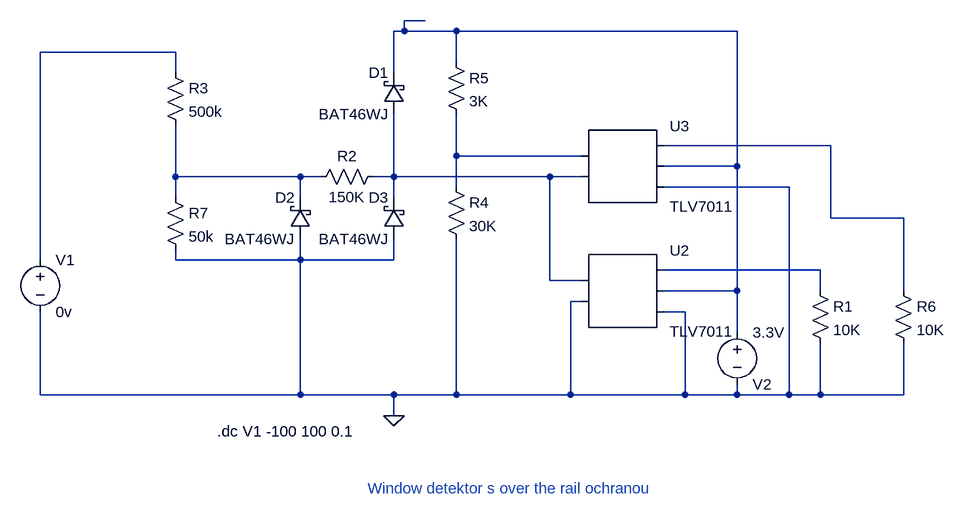
[diagram p0: schematic protection_alternativa.asc]
protection_alternativa.asc, the LTspice schematic file:
Version 4
SHEET 1 1204 680
WIRE 304 -240 272 -240
WIRE 272 -224 272 -240
WIRE 272 -224 256 -224
WIRE 352 -224 272 -224
WIRE 784 -224 352 -224
WIRE -80 -192 -288 -192
WIRE 352 -176 352 -224
WIRE -80 -160 -80 -192
WIRE 256 -160 256 -224
WIRE 928 -48 672 -48
WIRE 352 -32 352 -96
WIRE 544 -32 352 -32
WIRE 784 -16 784 -224
WIRE 784 -16 672 -16
WIRE -80 0 -80 -80
WIRE 112 0 -80 0
WIRE 144 0 112 0
WIRE 256 0 256 -96
WIRE 256 0 224 0
WIRE 496 0 256 0
WIRE 544 0 496 0
WIRE 352 16 352 -32
WIRE 864 16 672 16
WIRE -80 32 -80 0
WIRE 112 32 112 0
WIRE 256 32 256 0
WIRE 928 64 928 -48
WIRE 1040 64 928 64
WIRE -288 128 -288 -192
WIRE -80 128 -80 112
WIRE 112 128 112 96
WIRE 112 128 -80 128
WIRE 256 128 256 96
WIRE 256 128 112 128
WIRE 912 144 672 144
WIRE 496 160 496 0
WIRE 544 160 496 160
WIRE 784 176 784 -16
WIRE 784 176 672 176
WIRE 912 176 912 144
WIRE 1040 176 1040 64
WIRE 544 192 528 192
WIRE 704 208 672 208
WIRE 784 240 784 176
WIRE -288 336 -288 208
WIRE 112 336 112 128
WIRE 112 336 -288 336
WIRE 256 336 112 336
WIRE 352 336 352 96
WIRE 352 336 256 336
WIRE 528 336 528 192
WIRE 528 336 352 336
WIRE 704 336 704 208
WIRE 704 336 528 336
WIRE 784 336 784 320
WIRE 784 336 704 336
WIRE 864 336 864 16
WIRE 864 336 784 336
WIRE 912 336 912 256
WIRE 912 336 864 336
WIRE 1040 336 1040 256
WIRE 1040 336 912 336
WIRE 256 368 256 336
FLAG 256 368 0
SYMBOL voltage -288 112 R0
WINDOW 123 0 0 Left 0
WINDOW 39 0 0 Left 0
SYMATTR InstName V1
SYMATTR Value 0v
SYMBOL res 128 16 R270
WINDOW 0 32 56 VTop 2
WINDOW 3 0 56 VBottom 2
SYMATTR InstName R2
SYMATTR Value 150K
SYMBOL voltage 784 224 R0
WINDOW 0 24 96 Left 2
WINDOW 3 24 16 Left 2
WINDOW 123 0 0 Left 0
WINDOW 39 0 0 Left 0
SYMATTR InstName V2
SYMATTR Value 3.3V
SYMBOL AutoGenerated\\TLV7011 608 176 R0
SYMATTR InstName U2
SYMBOL res 896 160 R0
SYMATTR InstName R1
SYMATTR Value 10K
SYMBOL AutoGenerated\\TLV7011 608 -16 R0
SYMATTR InstName U3
SYMBOL res 336 0 R0
SYMATTR InstName R4
SYMATTR Value 30K
SYMBOL res 336 -192 R0
SYMATTR InstName R5
SYMATTR Value 3K
SYMBOL res 1024 160 R0
SYMATTR InstName R6
SYMATTR Value 10K
SYMBOL res -96 -176 R0
SYMATTR InstName R3
SYMATTR Value 500k
SYMBOL res -96 16 R0
SYMATTR InstName R7
SYMATTR Value 50k
SYMBOL schottky 272 -96 R180
WINDOW 0 24 64 Left 2
WINDOW 3 24 0 Left 2
SYMATTR InstName D1
SYMATTR Value BAT46WJ
SYMBOL schottky 272 96 R180
WINDOW 0 24 64 Left 2
WINDOW 3 24 0 Left 2
SYMATTR InstName D3
SYMATTR Value BAT46WJ
SYMBOL schottky 128 96 R180
WINDOW 0 24 64 Left 2
WINDOW 3 24 0 Left 2
SYMATTR InstName D2
SYMATTR Value BAT46WJ
TEXT -16 392 Left 2 !.dc V1 -100 100 0.1
TEXT 216 480 Left 2 ;Window detektor s over the rail ochranou

The netlist it stands for:
* protection_alternativa.asc
V1 N002 0 0v
R2 N005 N006 150K
V2 N001 0 3.3V
* U2: TLV7011 (symbol AutoGenerated\TLV7011 not available, pins judged from their places): pin1=N006 pin2=0 pin3=N007 pin4=N001 pin5=0
R1 N007 0 10K
* U3: TLV7011 (symbol AutoGenerated\TLV7011 not available, pins judged from their places): pin1=N004 pin2=N006 pin3=N003 pin4=N001 pin5=0
R4 N004 0 30K
R5 N001 N004 3K
R6 N003 0 10K
R3 N002 N005 500k
R7 N005 0 50k
D1 N006 N001 BAT46WJ
D3 0 N006 BAT46WJ
D2 0 N005 BAT46WJ
.model D D
.lib standard.dio
.dc V1 -100 100 0.1
* Window detektor s over the rail ochranou
.backanno
.end